# Altium schematic sheet Sheet1.SchDoc
size A4; SheetNumber: 1; SheetTotal: 1
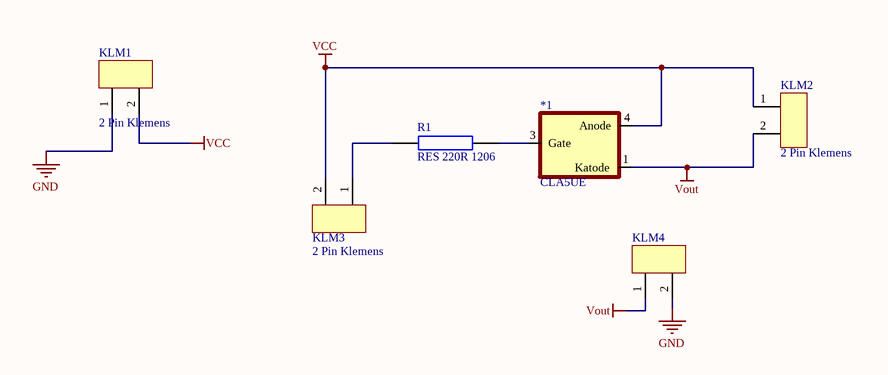
[diagram p0: Sheet1.SchDoc]

## Parts
*1  CLA5UE  [DPAK229P990X239-4N]
KLM1  2 Pin Klemens  [5.08mm-2 pin]
KLM2  2 Pin Klemens  [5.08mm-2 pin]
KLM3  2 Pin Klemens  [5.08mm-2 pin]
KLM4  2 Pin Klemens  [5.08mm-2 pin]  (value not drawn)
R1  RES 220R 1206  [RES_1206]

## Nets
GND: KLM1.1 KLM4.2
VCC: *1.4(Anode) KLM1.2 KLM2.1 KLM3.2
Vout: *1.1(Katode) KLM2.2 KLM4.1
Net*1_3: *1.3(Gate) R1.2
NetKLM3_1: KLM3.1 R1.1

## Library data of the parts
KLM1-KLM4 = 2 Pin Klemens: 5.08mm 2 pin klemens